# EAGLE design first (EAGLE 7.6.0)
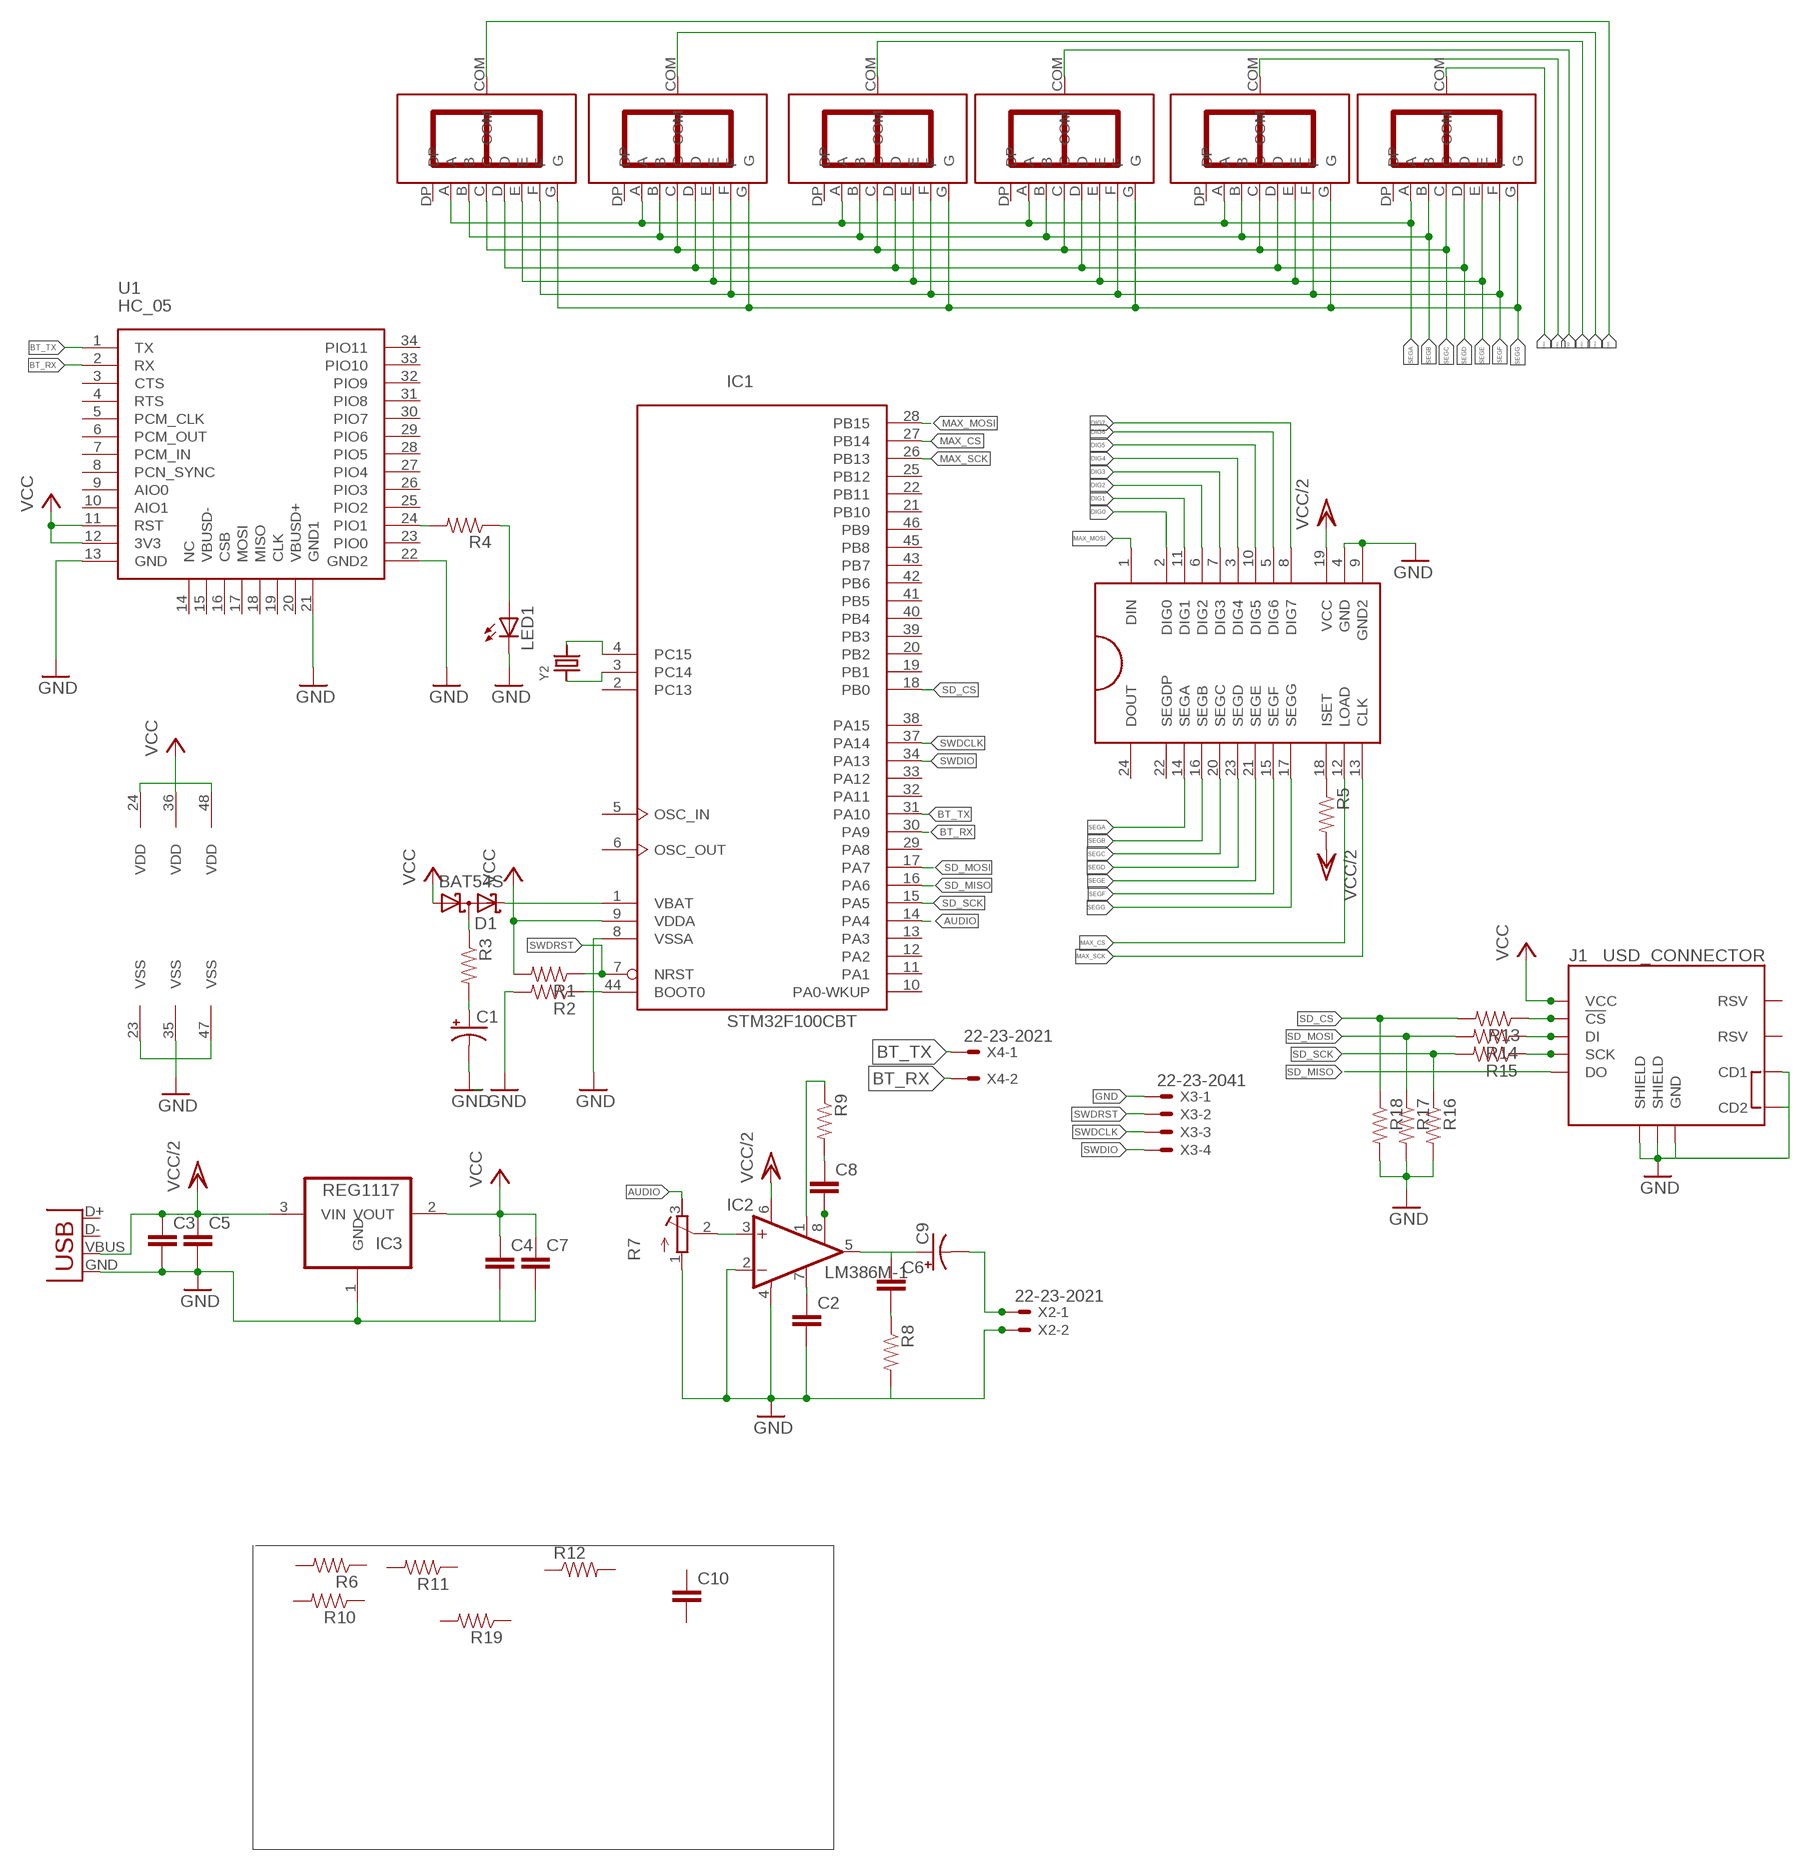
[diagram p0: schematic, sheet 1]

## Parts
C1  CAP_POLPTH2  [CPOL-RADIAL-10UF-25V]
C2  C-EUC0805K  [C0805K]
C3  C-EUC0805K  [C0805K]
C4  C-EUC0805K  [C0805K]
C5  C-EUC0805K  [C0805K]
C6  C-EUC0805K  [C0805K]
C7  C-EUC0805K  [C0805K]
C8  C-EUC0805K  [C0805K]
C9  CAP_POLD  [PANASONIC_D]
C10  CAP0402-CAP  [0402-CAP]
D1  BAT54S  [SOT23]
IC1  STM32F100CBT  [LQFP48]
IC2  LM386M-1  [SO08]
IC3  REG1117  [SOT223]
J1  USD_CONNECTOR  [MICRO-SD-SOCKET-PP]
LED1  LEDCHIP-LED0805  [CHIP-LED0805]
R1  RESISTOR0805-RES  [0805]
R2  RESISTOR0805-RES  [0805]
R3  RESISTOR0805-RES  [0805]
R4  RESISTOR0805-RES  [0805]
R5  RESISTOR0805-RES  [0805]
R6  RESISTOR0805-RES  [0805]
R7  R-TRIMM4G/J  [RTRIM4G/J]
R8  RESISTOR0805-RES  [0805]
R9  RESISTOR0805-RES  [0805]
R10  RESISTOR0805-RES  [0805]
R11  RESISTOR0805-RES  [0805]
R12  RESISTOR0402  [0402-RES]
R13  RESISTOR0805-RES  [0805]
R14  RESISTOR0805-RES  [0805]
R15  RESISTOR0805-RES  [0805]
R16  RESISTOR0805-RES  [0805]
R17  RESISTOR0805-RES  [0805]
R18  RESISTOR0805-RES  [0805]
R19  RESISTOR0805-RES  [0805]
U1  HC_05  [BLUETOOTH_SMD]
U$2  IV-9  [IV-9]
U$3  IV-9  [IV-9]
U$4  IV-9  [IV-9]
U$5  IV-9  [IV-9]
U$6  IV-9  [IV-9]
U$7  IV-9  [IV-9]
U$8  MAX7219SOIK42  [SO24L]
X1  USBSMD  [USB-MINIB]
X2  22-23-2021  [22-23-2021]
X3  22-23-2041  [22-23-2041]
X4  22-23-2021  [22-23-2021]
Y2  CRYSTAL8X3.8SMT  [CRYSTAL_8X3.8]

## Nets
AUDIO: IC1.14(PA4) R7.3(E)
BT_RX: IC1.30(PA9) U1.2(RX) X4.2
BT_TX: IC1.31(PA10) U1.1(TX) X4.1
DIG0: U$7.COM U$8.2(DIG0)
DIG1: U$6.COM U$8.11(DIG1)
DIG2: U$5.COM U$8.6(DIG2)
DIG3: U$4.COM U$8.7(DIG3)
DIG4: U$3.COM U$8.3(DIG4)
DIG5: U$2.COM U$8.10(DIG5)
DIG6: U$8.5(DIG6)
DIG7: U$8.8(DIG7)
GND: C1.2(-) C2.2 C3.2 C4.2 C5.2 C7.2 IC1.8(VSSA) IC1.23(VSS) IC1.35(VSS) IC1.47(VSS) IC2.2(-IN) IC2.4(GND) IC3.1(GND) J1.CD1 J1.CD2 J1.GND J1.GND1(SHIELD) J1.GND3(SHIELD) LED1.C R2.2 R7.1(A) R8.2 R16.2 R17.2 R18.2 U1.13(GND) U1.21(GND1) U1.22(GND2) U$8.4(GND) U$8.9(GND2) X1.GND X2.2 X3.1
MAX_CS: IC1.27(PB14) U$8.12(LOAD)
MAX_MOSI: IC1.28(PB15) U$8.1(DIN)
MAX_SCK: IC1.26(PB13) U$8.13(CLK)
N$1: IC1.4(PC15) Y2.P$4
N$2: IC1.3(PC14) Y2.P$1
N$4: C1.1(+) R3.2
N$5: D1.2(C2) IC1.1(VBAT)
N$6: R5.1 U$8.18(ISET)
N$7: C6.2 R8.1
N$8: IC1.44(BOOT0) R2.1
N$9: C2.1 IC2.7(BYPASS)
N$10: IC2.3(+IN) R7.2(S)
N$11: C6.1 C9.+ IC2.5(OUT)
N$12: C8.2 IC2.8(GAIN)
N$14: C8.1 R9.2
N$15: IC2.1(GAIN) R9.1
N$16: C9.- X2.1
N$19: D1.3(C1A2) R3.1
N$20: R4.2 U1.24(PIO1)
N$21: LED1.A R4.1
N$24: J1.CS(!CS) R13.1
N$25: J1.DI R14.1
N$26: J1.SCLK(SCK) R15.1
SD_CS: IC1.18(PB0) R13.2 R18.1
SD_MISO: IC1.16(PA6) J1.DO
SD_MOSI: IC1.17(PA7) R14.2 R17.1
SD_SCK: IC1.15(PA5) R15.2 R16.1
SEGA: U$2.A U$3.A U$4.A U$5.A U$6.A U$7.A U$8.14(SEGA)
SEGB: U$2.B U$3.B U$4.B U$5.B U$6.B U$7.B U$8.16(SEGB)
SEGC: U$2.C U$3.C U$4.C U$5.C U$6.C U$7.C U$8.20(SEGC)
SEGD: U$2.D U$3.D U$4.D U$5.D U$6.D U$7.D U$8.23(SEGD)
SEGE: U$2.E U$3.E U$4.E U$5.E U$6.E U$7.E U$8.21(SEGE)
SEGF: U$2.F U$3.F U$4.F U$5.F U$6.F U$7.F U$8.15(SEGF)
SEGG: U$2.G U$3.G U$4.G U$5.G U$6.G U$7.G U$8.17(SEGG)
SWDCLK: IC1.37(PA14) X3.3
SWDIO: IC1.34(PA13) X3.4
SWDRST: IC1.7(NRST) R1.1 X3.2
VCC: C4.1 C7.1 D1.1(A1) IC1.9(VDDA) IC1.24(VDD) IC1.36(VDD) IC1.48(VDD) IC3.2(VOUT) J1.VCC R1.2 U1.11(RST) U1.12(3V3)
VCC/2: C3.1 C5.1 IC2.6(VS) IC3.3(VIN) R5.2 U$8.19(VCC) X1.VBUS
Unconnected: C10.1 C10.2 IC1.2(PC13) IC1.5(OSC_IN) IC1.6(OSC_OUT) IC1.10(PA0-WKUP) IC1.11(PA1) IC1.12(PA2) IC1.13(PA3) IC1.19(PB1) IC1.20(PB2) IC1.21(PB10) IC1.22(PB11) IC1.25(PB12) IC1.29(PA8) IC1.32(PA11) IC1.33(PA12) IC1.38(PA15) IC1.39(PB3) IC1.40(PB4) IC1.41(PB5) IC1.42(PB6) IC1.43(PB7) IC1.45(PB8) IC1.46(PB9) J1.RSV1(RSV) J1.RSV2(RSV) R6.1 R6.2 R10.1 R10.2 R11.1 R11.2 R12.1 R12.2 R19.1 R19.2 U1.3(CTS) U1.4(RTS) U1.5(PCM_CLK) U1.6(PCM_OUT) U1.7(PCM_IN) U1.8(PCN_SYNC) U1.9(AIO0) U1.10(AIO1) U1.14(NC) U1.15(VBUSD-) U1.16(CSB) U1.17(MOSI) U1.18(MISO) U1.19(CLK) U1.20(VBUSD+) U1.23(PIO0) U1.25(PIO2) U1.26(PIO3) U1.27(PIO4) U1.28(PIO5) U1.29(PIO6) U1.30(PIO7) U1.31(PIO8) U1.32(PIO9) U1.33(PIO10) U1.34(PIO11) U$2.DP U$3.DP U$4.DP U$5.DP U$6.DP U$7.DP U$8.22(SEGDP) U$8.24(DOUT) X1.D+ X1.D-

## Library data of the parts
C1 = SparkFun-Passives:CAP_POL: Capacitor Polarized These are standard SMD and PTH capacitors. Normally 10uF, 47uF, and 100uF in electrolytic and tantalum varieties. Always verify the external diameter of the through hole cap, it varies with capacity, voltage, and manufacturer. The EIA devices should be standard.
C2-C8 = Icotech_Eagle_Library:C-EU: CAPACITOR, European symbol
C9 = SparkFun-Capacitors:CAP_POL: Capacitor Polarized These are standard SMD and PTH capacitors. Normally 10uF, 47uF, and 100uF in electrolytic and tantalum varieties. Always verify the external diameter of the through hole cap, it varies with capacity, voltage, and manufacturer. The EIA devices should be standard.
C10 = SparkFun-Passives:CAP: Capacitor Standard 0603 ceramic capacitor, and 0.1" leaded capacitor.
D1 = diode:BAT54S: Schottky Diodes Pin connection corrected 2011-05-04 Source: Fairchild .. BAT54.pdf
IC1 = stm32:STM32F100C*T: ARM 32-bit Cortex™-M3 CPU 24 MHz maximum frequency 16 to 128 Kbytes of Flash memory 4 to 8 kbytes of SRAM 37 GPIOs 2.0 to 3.6 V application supply
IC2 = linear:LM386?-*: Low Voltage Audio Power Amplifier Source: http://cache.national.com/ds/LM/LM386.pdf
IC3 = burr-brown:REG1117: 800mA and 1A Low Dropout (LDO) Positive Regulator 1.8V, 2.5V, 2.85V, 3.3V, 5V, and Adj; MPN: REG1117; OC_FARNELL: 1097566; OC_NEWARK: 14P6981
J1 = SparkFun-Connectors:USD_CONNECTOR: microSD Socket Push-push type µSD socket. Footprint production proven. Symbol has new and improved layout and naming accuracy. SparkFun Electronics SKU : PRT-00127. tDoc lines correctly indicate media card edge positions when inserting (unlocked, locked, depressed). NOTE: CD1 and CD2 are connected internally; PROD_ID: CONN-07820
LED1 = adafruit:LED: LED OSRAM: - CHIPLED LG R971, LG N971, LY N971, LG Q971, LY Q971, LO R971, LY R971 LH N974, LH R974 LS Q976, LO Q976, LY Q976 LO Q996 - Hyper CHIPLED LW Q18S LB Q993, LB Q99A, LB R99A - SideLED LS A670, LO A670, LY A670, LG A670, LP A670 LB A673, LV A673, LT A673, LW A673 LH A674 LY A675 LS A676, LA A676, LO A676, LY A676, LW A676 LS A679, LY A679, LG A679 - Hyper Micro SIDELED® LS Y876, LA Y876, LO Y876, LY Y876 LT Y87S - SmartLED LW L88C, LW L88S LB L89C, LB L89S, LG L890 LS L89K, LO L89K, LY L89K LS L896, LA L896, LO L896, LY L896 - TOPLED LS T670, LO T670, LY T670, LG T670, LP T670 LSG T670, LSP T670, LSY T670, LOP T670, LYG T670 LG T671, LOG T671, LSG T671 LB T673, LV T673, LT T673, LW T673 LH T674 LS T676, LA T676, LO T676, LY T676, LB T676, LH T676, LSB T676, LW T676 LB T67C, LV T67C, LT T67C, LS T67K, LO T67K, LY T67K, LW E67C LS E67B, LA E67B, LO E67B, LY E67B, LB E67C, LV E67C, LT E67C LW T67C LS T679, LY T679, LG T679 LS T770, LO T770, LY T770, LG T770, LP T770 LB T773, LV T773, LT T773, LW T773 LH T774 LS E675, LA E675, LY E675, LS T675 LS T776, LA T776, LO T776, LY T776, LB T776 LHGB T686 LT T68C, LB T68C - Hyper Mini TOPLED® LB M676 - Mini TOPLED Santana® LG M470 LS M47K, LO M47K, LY M47K Source: http://www.osram.convergy.de/
R1-R6 R8-R11 R13-R19 = SparkFun-Passives:RESISTOR: Resistor Basic schematic elements and footprints for 0603, 1206, and PTH resistors.
R7 = rcl:R-TRIMM: Trimm resistor
R12 = SparkFun-Resistors:RESISTOR: Resistor Basic schematic elements and footprints for 0603, 1206, and PTH resistors.
U1 = Bluetooth HC-05:HC_05: HC-05 Bluetooth Module
U$2-U$7 = ussr_tube:IV-9
U$8 = MAX7219:MAX7219: 8-digit, 8-segment LED display driver, serial input
X1 = SparkFun:USB: USB Connectors USB-B-PTH is fully proven SKU : PRT-00139 USB-miniB is fully proven SKU : PRT-00587 USB-A-PCB is untested. USB-A-H is throughly reviewed, but untested. Spark Fun Electronics SKU : PRT-00437 USB-B-SMT is throughly reviewed, but untested. Needs silkscreen touching up. USB-A-S has not been used/tested USB-MB-H has not been used/tested
X2 X4 = con-molex:22-23-2021: .100" (2.54mm) Center Header - 2 Pin; MF: MOLEX; MPN: 22-23-2021; OC_FARNELL: 1462926; OC_NEWARK: 25C3832
X3 = con-molex:22-23-2041: .100" (2.54mm) Center Header - 4 Pin; MF: MOLEX; MPN: 22-23-2041; OC_FARNELL: 1462920; OC_NEWARK: 38C0355
Y2 = microbuilder:CRYSTAL: Crystals HC49UP - Surface Mount Crystal 4.0MHz 18pF +/-30ppm Surface Mount Crystal [Digikey: 535-9857-1-ND] 12.0 MHz Surface Mount Crystal [Digikey: 535-9869-6-ND] 25.0 MHz Surface Mount Crystal [Digikey: 535-9078-1-ND] 2.5 x 2.0mm - MEMs SMT Crystal 16.0 MHz 10pF 20ppm 2.5 x 2.0mm Crystal [Digikey -40-85°C: 535-10923-1-ND] 3.2 x 2.5mm - MEMs SMT Crystal 12.0 MHz 8pF 15ppm 3.2 x 2.5mm Crystal [Digikey: -10-70°C: 644-1047-1-ND -40-125°C: 644-1128-1-ND] 16.0 MHz 8pF 15ppm 3.2 x 2.5mm Crystal [Digikey: -10-70°C: 644-1049-1-ND -40-125°C: 644-1129-2-ND] 16.0 MHz 10pF 10ppm 3.2 x 2.5mm Crystal [Digikey: 644-1100-1-ND] 27.12 MHz 18pF 30ppm 3.2 x 2.5mm Crystal [Digikey: 887-1424-1-ND] 27.12MHz 10pF 10ppm 3.2 x 2.5mm Crystal [Digikey: 887-1329-1-ND] 4.9 x 1.8mm - MEMs SMT Crystal 32.768 KHz 12.5pF 20ppm 4.9 x 1.8mm Crystal [Digikey: SE2415CT-ND] 8.0 x 3.8mm - Surface Mount Crystal 32.768kHz 12.5pF 20ppm -40°C-85°C [Digikey: 535-9166-2-ND] Cylinder 32.768KHz Cylinder Crystal (2x6mm body) [Ex. Digikey: 300-8341-2-ND]

## Board
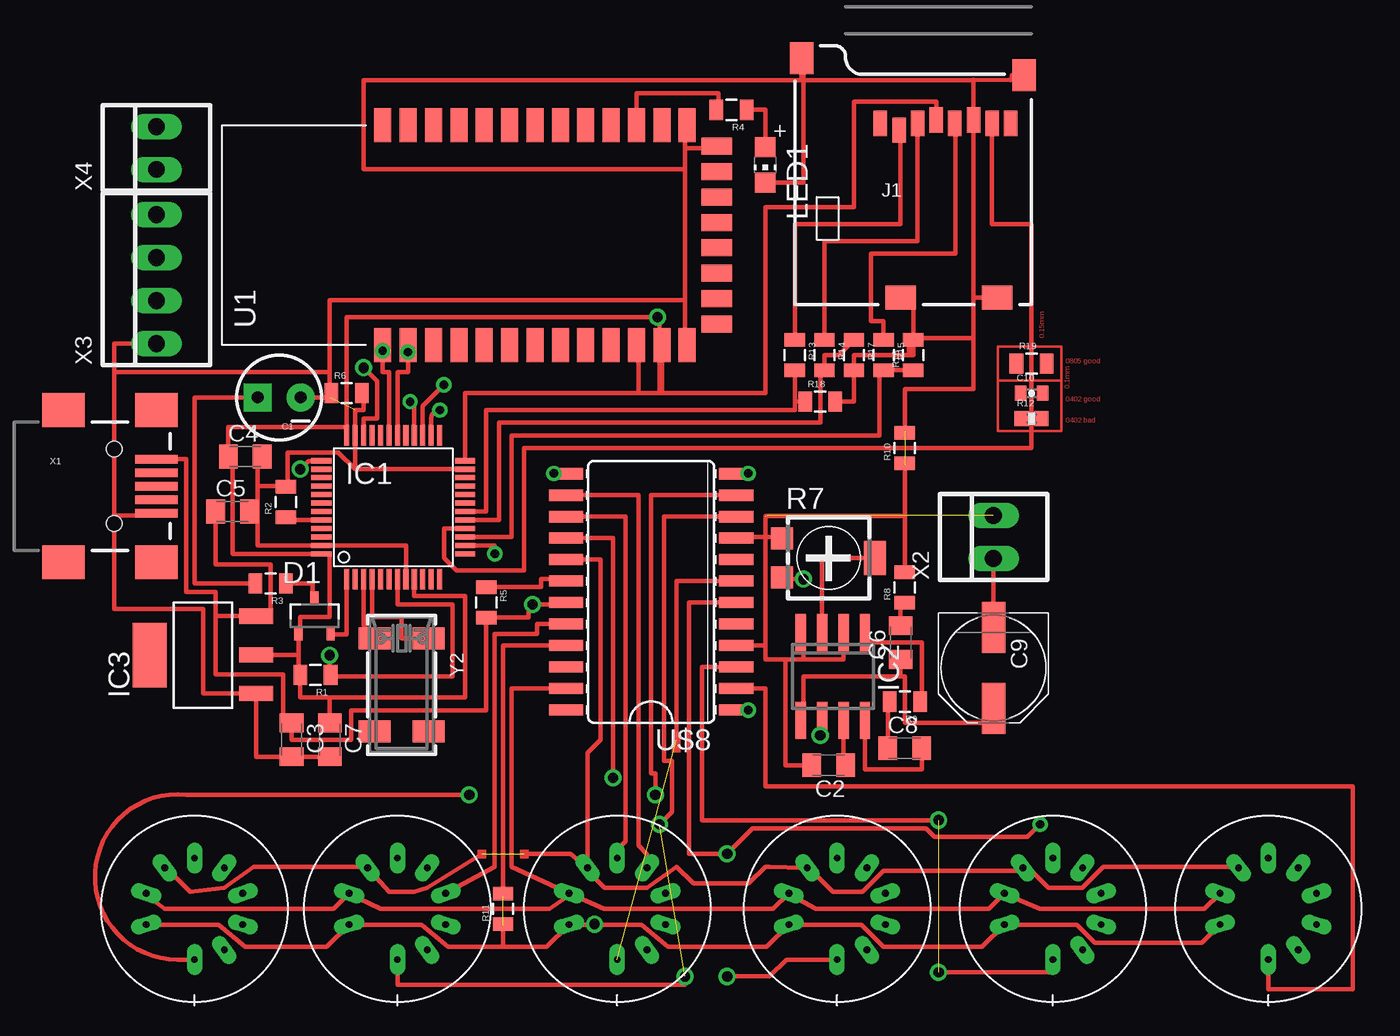
[diagram p1: board, top side]
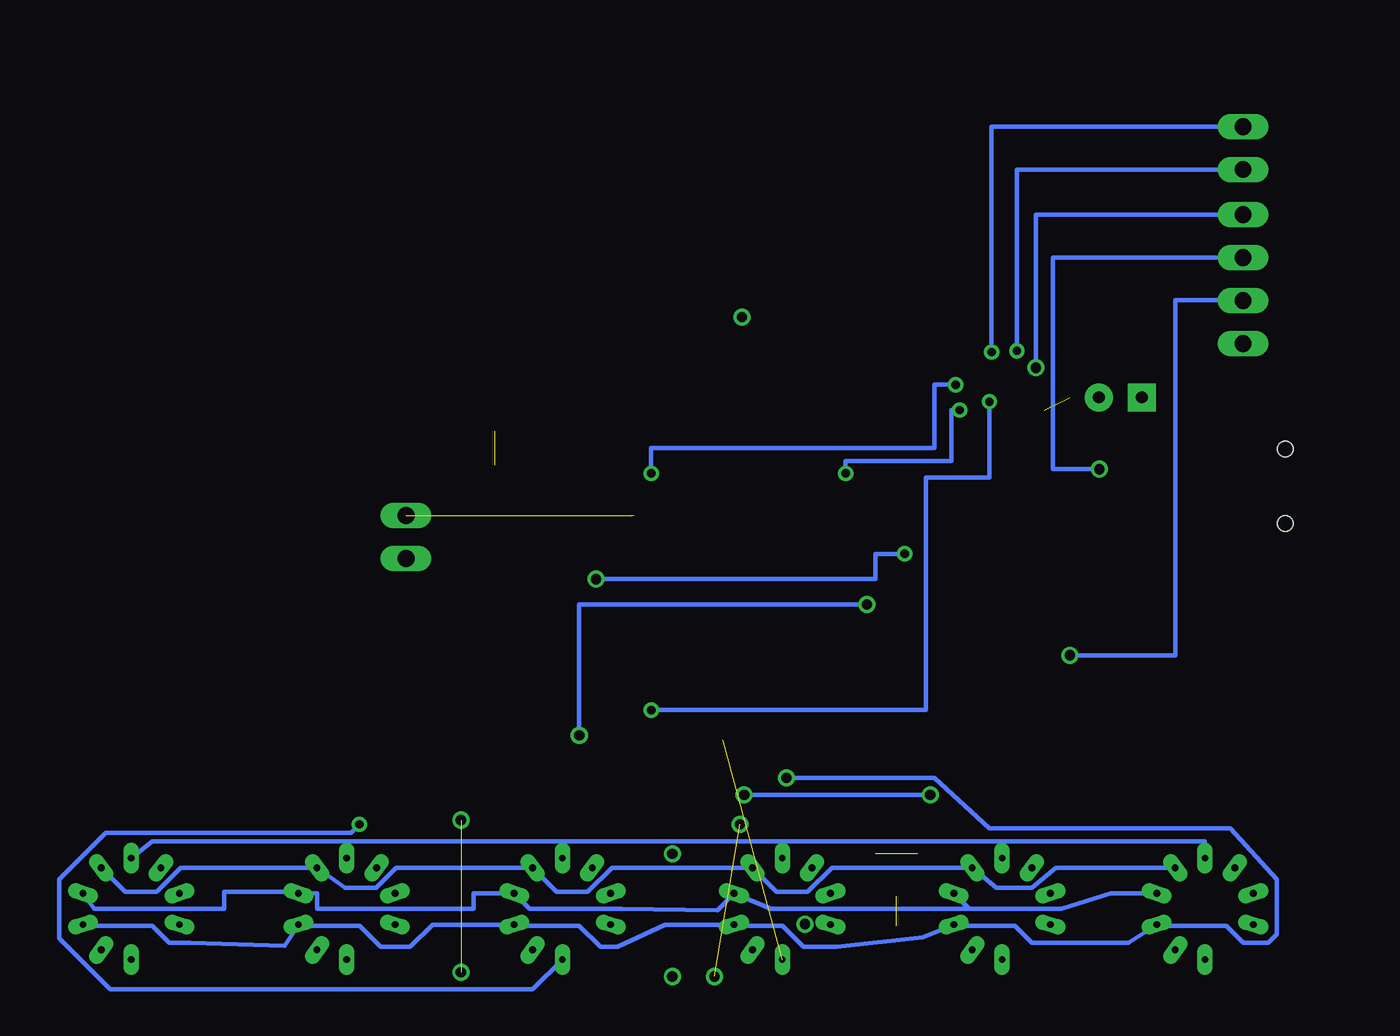
[diagram p2: board, bottom side, seen from below]

No outline drawn. Coordinates in mm, seen from the top.
Copper layers (1*16): Top 0.035mm / dielectric 1.5mm / Bottom 0.035mm
Design rules "default": minimum track width 10mil, minimum drill 24mil, track to track 8mil, track to pad 8mil, pad to pad 8mil, via to via 8mil, smd to smd 8mil, copper to edge 40mil, drill to drill 8mil, minimum pad ring 10mil, minimum via ring 8mil, stop-mask expansion 4mil, vias tented up to drill 0mil, thermal gap 10mil

### Footprints (pad centres in the part's own frame; a part is rotated, then mirrored left to right if it is on the bottom)
CPOL-RADIAL-10UF-25V = drill 0.7 pad 1.651 square: 1 1.27,0 | drill 0.7 pad 1.651: 2 -1.27,0
C0805K = smd 1.1 x 1.4: 1 -1,0; 2 1,0
PANASONIC_D = smd 3 x 1.4: + 2.4,0; - -2.4,0
0402-CAP = smd 0.7 x 0.9: 1 -0.65,0; 2 0.65,0
SOT23 = smd 0.5 x 0.7: 1 -0.95,-1.1; 2 0.95,-1.1; 3 0,1.1
LQFP48 = smd 0.3 x 1.2: 1 -2.75,-4.25; 2 -2.25,-4.25; 3 -1.75,-4.25; 4 -1.25,-4.25; 5 -0.75,-4.25; 6 -0.25,-4.25; 7 0.25,-4.25; 8 0.75,-4.25; 9 1.25,-4.25; 10 1.75,-4.25; 11 2.25,-4.25; 12 2.75,-4.25; 25 2.75,4.25; 26 2.25,4.25; 27 1.75,4.25; 28 1.25,4.25; 29 0.75,4.25; 30 0.25,4.25; 31 -0.25,4.25; 32 -0.75,4.25; 33 -1.25,4.25; 34 -1.75,4.25; 35 -2.25,4.25; 36 -2.75,4.25 | smd 1.2 x 0.3: 13 4.25,-2.75; 14 4.25,-2.25; 15 4.25,-1.75; 16 4.25,-1.25; 17 4.25,-0.75; 18 4.25,-0.25; 19 4.25,0.25; 20 4.25,0.75; 21 4.25,1.25; 22 4.25,1.75; 23 4.25,2.25; 24 4.25,2.75; 37 -4.25,2.75; 38 -4.25,2.25; 39 -4.25,1.75; 40 -4.25,1.25; 41 -4.25,0.75; 42 -4.25,0.25; 43 -4.25,-0.25; 44 -4.25,-0.75; 45 -4.25,-1.25; 46 -4.25,-1.75; 47 -4.25,-2.25; 48 -4.25,-2.75
SO08 = smd 0.6 x 2.2: 1 -1.905,-2.6; 2 -0.635,-2.6; 3 0.635,-2.6; 4 1.905,-2.6; 5 1.905,2.6; 6 0.635,2.6; 7 -0.635,2.6; 8 -1.905,2.6
SOT223 = smd 0.9 x 2.007: 1 -2.261,-3.15; 2 0.025,-3.15; 3 2.311,-3.15 | smd 3.81 x 2.007: 4 0,3.15
MICRO-SD-SOCKET-PP = smd 1.8 x 1.4: CD1 -2.05,0.4; CD2 -7.75,0.4 | smd 0.8 x 1.5: CS -7.84,10.3; DI -6.74,10.7; DO -2.34,10.7; GND -3.44,10.9; RSV1 -8.94,10.7; RSV2 -1.24,10.7; SCLK -4.54,10.7; VCC -5.64,10.9 | smd 1.4 x 1.9: GND1 -13.6,14.55; GND3 -0.45,13.55
CHIP-LED0805 = smd 1.2 x 1.2: A 0,-1.05; C 0,1.05
0805 = smd 0.8 x 1.2: 1 -0.9,0; 2 0.9,0
RTRIM4G/J = smd 1.3 x 1.3: 1 -1.15,-2.75; 3 1.15,-2.75 | smd 2 x 1.3: 2 0,2.75
0402-RES = smd 0.85 x 0.9: 1 -0.58,0; 2 0.58,0
BLUETOOTH_SMD = smd 2 x 1: 1 -6.35,3.81; 2 -6.35,2.31; 3 -6.35,0.81; 4 -6.35,-0.69; 5 -6.35,-2.19; 6 -6.35,-3.69; 7 -6.35,-5.19; 8 -6.35,-6.69; 9 -6.35,-8.19; 10 -6.35,-9.69; 11 -6.35,-11.19; 12 -6.35,-12.69; 13 -6.35,-14.19; 22 6.65,-14.19; 23 6.65,-12.69; 24 6.65,-11.19; 25 6.65,-9.69; 26 6.65,-8.19; 27 6.65,-6.69; 28 6.65,-5.19; 29 6.65,-3.69; 30 6.65,-2.19; 31 6.65,-0.69; 32 6.65,0.81; 33 6.65,2.31; 34 6.65,3.81 | smd 1 x 1.8: 14 -5.1,-15.94; 15 -3.6,-15.94; 16 -2.1,-15.94; 17 -0.6,-15.94; 18 0.9,-15.94; 19 2.4,-15.94; 20 3.9,-15.94; 21 5.4,-15.94
IV-9 = drill 0.4 pad 0.8 long: A -2.427,1.763; B 0.927,2.853; C -0.927,2.853; COM 3,0; D -0.927,-2.853; DP 2.427,1.763; E 0.927,-2.853; F -3,0; G -2.427,-1.763
SO24L = smd 0.66 x 2.032: 1 -6.985,-5.029; 2 -5.715,-5.029; 3 -4.445,-5.029; 4 -3.175,-5.029; 5 -1.905,-5.029; 6 -0.635,-5.029; 7 0.635,-5.029; 8 1.905,-5.029; 9 3.175,-5.029; 10 4.445,-5.029; 11 5.715,-5.029; 12 6.985,-5.029; 13 6.985,5.029; 14 5.715,5.029; 15 4.445,5.029; 16 3.175,5.029; 17 1.905,5.029; 18 0.635,5.029; 19 -0.635,5.029; 20 -1.905,5.029; 21 -3.175,5.029; 22 -4.445,5.029; 23 -5.715,5.029; 24 -6.985,5.029
USB-MINIB = smd 2.5 x 0.5: D+ 2.5,0; D- 2.5,0.8; GND 2.5,-1.6; ID 2.5,-0.8; VBUS 2.5,1.6 | smd 2.5 x 2: GND@1 -3,-4.5; GND@2 -3,4.5; GND@3 2.5,4.5; GND@4 2.5,-4.5 | hole 0.9: 0,2.2; 0,-2.2
22-23-2021 = drill 1 long: 1 -1.27,0; 2 1.27,0
22-23-2041 = drill 1 long: 1 -3.81,0; 2 -1.27,0; 3 1.27,0; 4 3.81,0
CRYSTAL_8X3.8 = smd 1.3 x 1.9: P$1 -2.75,-1.6; P$2 2.75,-1.6; P$3 2.75,1.6; P$4 -2.75,1.6

### Placement (x,y rotation side)
C1  14.5,38.75 180 top
C2  47,17 180 top
C3  15.25,18.5 270 top
C4  12.5,35.25 0 top
C5  11.75,32 0 top
C6  51.25,24.25 90 top
C7  17.5,18.5 270 top
C8  51.5,18 0 top
C9  56.75,22.75 270 top
C10  59,39 0 top
D1  16.6,25.84 0 top
IC1  21.25,32.25 0 top
IC2  47.25,22.25 180 top
IC3  10,23.5 90 top
J1  59,44.25 0 top
LED1  43.25,52.5 180 top
R1  16.65,22.34 180 top
R2  14.9,32.56 90 top
R3  14,27.75 180 top
R4  41.25,55.75 180 top
R5  26.75,26.62 270 top
R6  18.5,39 0 top
R7  47,29.25 270 top
R8  51.5,27.5 90 top
R9  51.5,20.75 180 top
R10  51.5,35.75 90 top
R11  27.75,8.5 90 top
R12  59,37.5 0 top
R13  45,41.25 270 top
R14  46.75,41.25 270 top
R15  50.25,41.25 270 top
R16  52,41.25 90 top
R17  48.5,41.25 270 top
R18  46.5,38.5 0 top
R19  59,40.75 0 top
U1  24.45,48.2 90 top
U$2  21.5,8.5 270 top
U$3  60.25,8.5 270 top
U$4  34.5,8.5 270 top
U$5  47.5,8.5 270 top
U$6  9.5,8.5 270 top
U$7  73,8.5 270 top
U$8  36.5,27.25 90 top
X1  4.75,33.5 0 top
X2  56.75,30.5 90 top
X3  7.25,45.75 90 top
X4  7.25,53.5 90 top
Y2  21.75,21.75 270 top

### Tracks (layer width: path | path; a pad name or v marks a point on that pad's centre or on a via)
AUDIO  (via drill 0.5, 0.6)
  Top 0.254: IC1.14 27.25,30 v27.25,29.5 | v45.5,28 44.25,28 R7.3
  Bottom 0.254: v27.25,29.5 29,29.5 29,28 v45.5,28
BT_RX
  Top 0.254: IC1.30 21.5,40.25 22.14,40.25 U1.2
  Bottom 0.254: X4.2 22.14,54.77 U1.2 22.14,41.25
BT_TX  (1 unrouted)
  Top 0.254: IC1.31 21,40.25 20.64,40.25 U1.1
  Bottom 0.254: X4.1 20.64,52.23 20.64,41.25
DIG0
  Top 0.254: U$8.2 43.25,21.54 43.25,15.75 78,15.75 78,3.75 73,3.75 U$7.COM
DIG1  (via drill 0.6)
  Top 0.254: U$8.11 36.5,32.97 36.5,16.5 36.75,16.5 v36.75,15.25 | U$6.COM 8.5,5.5 arc-186 9,15.25 v25.75,15.25
  Bottom 0.254: v25.75,15.25 v36.75,15.25
DIG2  (via drill 0.5, 0.6)
  Top 0.254: U$8.6 38.75,26.61 38.75,11.75 v41,11.75 42.5,13.25 52.75,13.25 53.25,12.75 58.75,12.75 v59.5,13.5 | U$5.COM 44.5,5.5 43.5,4.5 41,4.5
  Bottom 0.254: v59.5,13.5 60,13 74.5,13 77.25,10.25 77.25,6.75 74.25,3.75 49.25,3.75 U$5.COM
DIG3  (1 unrouted)
  Top 0.254: U$8.7 38,27.89 38,18.5
DIG4  (via drill 0.6)  (1 unrouted)
  Top 0.254: U$8.3 39.5,22.8 39.5,13.75 v53.5,13.75 | U$3.COM 60.25,4.75 v53.5,4.75
DIG5  (via drill 0.6)  (1 unrouted)
  Top 0.254: U$8.10 37.25,31.7 37.25,17.25 37.75,17.25 37.75,14.25 37,13.5 | U$2.COM 21.5,4 38.5,4 v38.5,4.5
GND  (4 unrouted)
  Top 0.254: IC1.23 19,34.5 | 19,34.5 IC1.35 19,38 19.5,38 19.5,39 | R2.2 15,33.52 | 15,33.52 15,35.5 18,35.5 19,34.5 | 15,33.52 14.98,33.5 13.25,33.5 | 13.25,32 13.25,30 IC1.47 22,30 IC1.8 | U1.22 38.5,54.84 38.5,53.5 | 38.5,53.5 40.38,53.5 U1.21 | U1.13 38.5,41.84 38.5,44.5 | 38.5,44.5 38.5,52.25 | 38.5,52.25 38.5,53.5 | C1.2 17.5,38.75 17.5,40.25 | 17.5,40.25 17.5,44.5 38.5,44.5 | C5.2 13.25,32 | 13.25,32 13.25,33.5 | 4.75,31.75 4.75,26.25 10,26.25 10,21.24 IC3.1 13.15,17.5 C3.2 C7.2 | 4.75,31.75 7.25,31.75 X1.GND | 4.75,40.25 17.5,40.25 | 13.25,33.5 13.25,35 C4.2 | 51.75,41.25 52,41.25 R16.2 52,44.65 J1.CD2 | J1.GND3 57.84,57.8 57.84,57.56 57.75,57.56 57.75,57.5 55.56,57.55 55.56,57.5 | 55.56,57.5 J1.GND 55.56,44.65 | 55.56,57.5 45.5,57.5 | 45.5,57.5 45.5,58.8 J1.GND1 45.4,57.5 19.5,57.5 19.5,52.25 38.5,52.25 | R18.2 48.5,38.5 R17.2 48.5,41.25 51.75,41.25 | 51.75,41.25 51.75,42.25 55.55,42.25 | 55.55,42.25 55.56,42.25 55.56,44.65 | J1.CD1 55.56,44.65 | LED1.C 45.5,51.45 45.5,57.5 | 4.75,40.25 4.75,31.75 | U$8.4 43.25,24.07 | 43.25,24.07 43.25,30.5 | 43.25,30.5 41.53,30.5 U$8.9 | 43.25,30.5 43.25,31.73 51.5,31.73 | 51.5,31.73 51.5,34.75 | 51.5,36.75 51.5,39.25 55.55,39.25 55.55,42.25 | 43.25,30.5 44.25,30.5 R7.1 | IC2.2 47.88,23.25 45.5,23.25 | 45.5,23.25 45.5,24.85 IC2.4 | 43.25,24.07 43.25,23.25 44.45,23.25 | 44.45,23.25 45.5,23.25 | C2.2 44.45,17 44.45,23.25 | 51.5,31.73 R8.2 | X3.1 4.75,41.94 4.75,40.25
MAX_CS  (via drill 0.5)
  Top 0.254: IC1.27 23,38.25 v24.25,39.5 | v42.25,34.25 42,34.25 41.53,34.25 U$8.12
  Bottom 0.254: v24.25,39.5 25.5,39.5 25.5,35.75 42.25,35.75 v42.25,34.25
MAX_MOSI  (via drill 0.5)
  Top 0.254: IC1.28 22.5,38.25 v22.25,38.5 | v42.25,20.25 41.53,20.25 U$8.1
  Bottom 0.254: v22.25,38.5 22.25,34 26,34 26,20.27 42.25,20.27 v42.25,20.25
MAX_SCK  (via drill 0.5)
  Top 0.254: U$8.13 31.47,34.25 v30.75,34.25 | v24,38 arc90 23.5,37.5 IC1.26
  Bottom 0.254: v30.75,34.25 30.75,35 24.5,35 24.5,38 v24,38
N$1
  Top 0.254: Y2.P$4 21.75,24.5 21.75,25.75 20,25.75 IC1.4
N$2
  Top 0.254: Y2.P$1 19.5,25.25 IC1.3
N$3  (via drill 0.6)
  other vias: 41,4.5
N$4
  Top 0.254: C1.1 9.5,38.75 9.5,27.75 R3.2
N$5
  Top 0.254: D1.2 18.5,24.73 IC1.1
N$6
  Top 0.254: R5.1 30,27.52 30,28 31.47,28 U$8.18
N$7
  Top 0.254: R8.1 51.25,26.6 C6.2
N$8
  Top 0.254: R2.1 14.77,31.5 IC1.44
N$9
  Top 0.254: C2.1 47.88,17 IC2.7
N$10
  Top 0.254: IC2.3 46.62,29.25 R7.2
N$11
  Top 0.254: IC2.5 45.5,19.65 45.5,22.25 51.25,22.25 | 51.25,22.25 C6.1 | 51.25,22.25 51.5,22.25 51.5,19.5 56.75,19.5 C9.+
N$12
  Top 0.254: C8.2 52.5,16.75 49.16,16.75 IC2.8
N$13  (via drill 0.6)
  other vias: 37,13.5
N$14
  Top 0.254: R9.2 50.5,20.75 C8.1
N$15
  Top 0.254: R9.1 52.5,20.75 52.5,24.25 49.16,24.25 IC2.1
N$16
  Top 0.254: C9.- X2.1
N$17  (via drill 0.6)
  other vias: 33.15,7.6
N$18  (via drill 0.5)
  other vias: 20.62,41.5
N$19
  Top 0.254: D1.3 16.5,26.93 16.5,27.75 R3.1
N$20
  Top 0.254: U1.24 35.63,56.75 40.5,56.75 40.5,55.75 R4.2
N$21
  Top 0.254: R4.1 43.25,55.75 LED1.A
N$22  (via drill 0.5)
  other vias: 22.12,41.43
N$23
  Top 0.15: 57,39.75 60.75,39.75 | 60.75,39.75 60.75,36.75 57,36.75 57,39.75 | 57,39.75 57,41.75 60.75,41.75 60.75,39.75
N$24
  Top 0.254: R13.1 45,49 51.25,49 51.25,54.55 J1.CS
N$25
  Top 0.254: R14.1 46.75,48 52.26,48 J1.DI
N$26
  Top 0.254: J1.SCLK 54.5,54.95 54.5,47.25 49.5,47.25 49.5,43.25 50.25,43.25 R15.1
SD_CS
  Top 0.254: R13.2 45,38.5 | 45,38.5 45,38 26.75,38 26.75,32 IC1.18 | R18.1 45,38.5
SD_MISO
  Top 0.254: 56.75,54.95 J1.DO 56.66,49 59,49 59,35.75 29,35.75 29,28.5 25,28.5 24.25,29.25 24.25,31 IC1.16
SD_MOSI
  Top 0.254: R17.1 47.6,41.25 46.75,41.25 R14.2 46.5,40.35 46.5,37.25 27.5,37.25 27.5,31.5 IC1.17
SD_SCK
  Top 0.254: R16.1 R15.2 50,40.35 50,36.5 28.25,36.5 28.25,30.5 IC1.15
SEGA
  Top 0.254: U$8.14 35.75,32.97 35.75,12.25 36.26,11.74 U$4.A
  Bottom 0.254: U$7.A 73.34,9.5 71.5,9.5 70.07,10.93 U$3.A 60.34,9.75 58.5,9.75 57.32,10.93 U$5.A 47.84,9.5 46,9.5 44.57,10.93 U$4.A 34.84,9.5 33,9.5 31.57,10.93 U$2.A 21.84,9.75 19.75,9.75 18.32,10.93 U$6.A
SEGB  (via drill 0.6)
  Top 0.254: U$8.16 34.25,30.43 v34.25,16.25
  Bottom 0.254: U$7.B 75.78,7.5 71.75,7.5 70.75,6.5 69.5,6.5 63.93,6.32 U$3.B 63.03,7.5 59.5,7.5 58.25,6.25 56.5,6.25 55.18,7.57 U$5.B 50.28,7.5 46.5,7.5 45.25,6.25 44.25,6.25 41.43,7.57 U$4.B 37.28,7.5 34.5,7.5 33.25,6.25 31.25,6.25 26.18,6.82 U$2.B 24.28,7.5 20.75,7.5 19.75,6.5 18,6.5 14.03,6.48 U$6.B 12.25,7.5 8.25,7.5 7.25,6.5 5.75,6.5 5.25,7 5.25,10.25 8,13.25 22.25,13.25 25.5,16.25 v34.25,16.25
SEGC
  Top 0.254: U$8.20 29.75,25.34 29.75,24.75 27.25,24.75 27.25,11 U$2.C
  Bottom 0.254: U$5.C 49.43,8.5 44,8.5 38.32,8.43 U$4.C 35.18,8.5 23.5,8.5 24.32,9.43 U$2.C 23.43,8.5 18,8.5 15.07,9.43 U$6.C | U$5.C 50.32,9.43 | U$5.C 52.75,9.43 52.75,8.5 61.99,8.5 62,9.25 62,9.43 U$3.C 63.07,9.43 63.5,9.5 67.5,9.5 67.5,8.5 75.18,8.5 U$7.C
SEGD
  Top 0.254: U$4.D 31.82,9.43 30.5,8.5 20.5,8.5 18.57,9.43 U$2.D 17.72,8.5 7.75,8.5 6.82,9.18 U$6.D | U$7.D 69.22,8.5 59.5,8.5 57.32,9.43 U$3.D 56.47,8.5 46.25,8.5 44.57,9.43 U$5.D 43.72,8.5 33.72,8.5 U$4.D | U$8.23 28.25,21.54 28.25,11 U$4.D
SEGE  (1 unrouted)
  Top 0.254: U$7.E 69.07,6.5 62.75,6.5 61.68,7.57 U$3.E 56.07,6.25 50.25,6.25 48.93,7.57 U$5.E 43.32,6.25 37.5,6.25 35.93,7.57 U$4.E 30.32,6.25 27.75,6.25 | U$6.E 10.93,7.57 12.5,6.25 17.32,6.25 U$2.E 22.93,7.57 24.5,6.25 27.75,6.25 | U$8.21 27.75,24.07 27.75,9.25 | 27.75,6.25 27.75,7.5
SEGF
  Top 0.254: U$8.15 35,31.7 35,12.5 34.5,12 U$4.F
  Bottom 0.254: 34.5,12.5 47.5,12.5 | U$5.F 47.5,12.5 | 47.5,12.5 60.25,12.5 | U$3.F 60.25,12.5 | 60.25,12.5 71.75,12.5 U$7.F | U$6.F 9.5,12.5 21.5,12.5 | U$2.F 21.5,12.5 | 21.5,12.5 34.5,12.5 | 34.5,12.5 U$4.F
SEGG  (1 unrouted)
  Top 0.254: U$7.G 71.16,11 63.25,11 62,9.75 60,9.75 58.82,10.93 U$3.G 58.31,10.75 50.25,10.75 49,9.5 47.25,9.5 45.82,10.93 U$5.G 45.57,10.93 43.5,11 43.25,11 42.25,10 39,10 38,11 36.25,9.75 33.75,9.75 32.74,10.76 U$4.G | U$6.G 7.74,11.01 9.25,9.5 11.25,9.75 13,11 19.66,11 U$2.G | 19.56,11 U$2.G | U$8.17 33.5,29.16 33.5,18.5 32.74,17.74 U$4.G | U$2.G 21,9.5 22.5,9.5 23.25,9.75 26.5,11.75 | U$4.G 31.75,11.75 29,11.75
SWDCLK  (via drill 0.6)
  Top 0.254: IC1.37 16.25,35 v15.75,34.5
  Bottom 0.254: v15.75,34.5 18.5,34.52 18.5,46.5 18.5,47 18.5,47.02 X3.3
SWDIO  (via drill 0.6)
  Top 0.254: IC1.34 19.5,37.5 20.3,37.5 20.3,39.7 v19.5,40.5
  Bottom 0.254: v19.5,40.5 19.5,48.25 19.5,49.5 19.5,49.56 X3.4
SWDRST  (via drill 0.6)
  Top 0.254: 17.6,22.25 24.75,22.25 24.75,26.5 21.5,26.5 IC1.7 | 17.6,22.25 R1.1 | 17.6,22.25 17.5,22.25 v17.5,23.5
  Bottom 0.254: v17.5,23.5 11.25,23.5 11.25,44.5 7.25,44.5 X3.2
VCC  (via drill 0.6)
  Top 0.254: IC1.24 25.5,39 35.75,39 | 35.75,39 37,39 | 37,39 37.13,39 | 37.13,39 U1.12 | IC1.36 18.5,37 | 18.5,37 18.5,43.5 v36.88,43.5 37,43.5 37,39 | 18.5,37 11.5,37 C4.1 11.75,35.25 11.75,29.5 IC1.48 17.5,29.5 17.5,25.75 15.75,25.75 15.75,24.73 D1.1 15.65,23.52 | U1.11 35.75,41.84 35.75,39 | 15.65,21.84 15.65,22.25 | 15.65,22.25 15.65,23.52 | IC1.9 22.5,27 25.5,27 25.5,21 17.5,21 | C7.1 17.5,21 | IC3.2 15.65,23.52 | 17.5,21 15.75,21 R1.2 15.75,22.25 15.65,22.25 | 53.5,55.4 J1.VCC 53.36,56.25 48.5,56.25 48.5,50 43.25,50 43.25,39 37.13,39
VCC/2  (via drill 0.6)
  Top 0.254: X1.VBUS 9,35.1 9,27.25 10.75,27.25 10.75,25.81 | 10.75,25.81 IC3.3 14,25.81 14,28.88 10.75,28.88 C5.1 | 10.75,25.81 10.75,22.38 14.75,22.38 14.75,19.75 C3.1 15.25,18.5 18.75,18.5 18.75,20.25 26.75,20.25 R5.2 29.25,25.73 29.25,26.5 v29.5,26.5 | v29.5,26.5 30.75,26.5 | 30.75,26.5 31,26.5 | 30.75,26.5 30.75,26.61 U$8.19 31.75,26.49 v29.5,26.5 | v46.5,18.75 46.62,18.75 IC2.6
  Bottom 0.254: v29.5,26.5 46.5,26.5 v46.5,18.75
(copper drawn outside any net)
  shapes: Top area x3

### Text on the board
Top: 0.15mm | 0805 good | 0.1mm | 0402 good | 0402 bad